# Altium schematic sheet Bridge.SchDoc
size A4
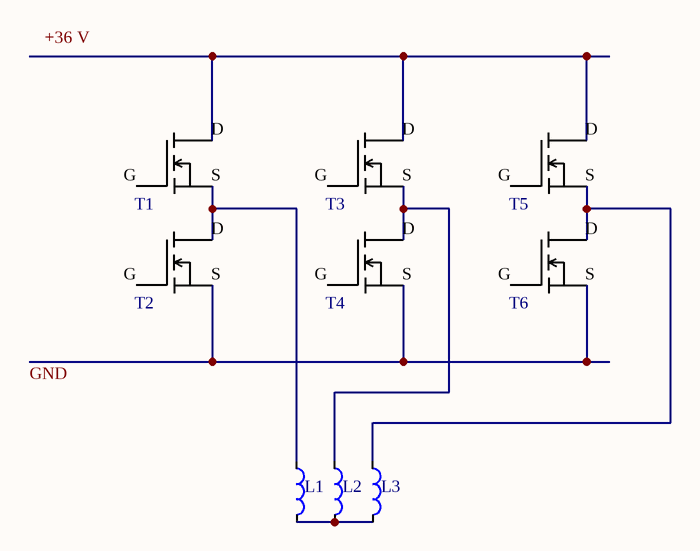
[diagram p0: Bridge.SchDoc]

## Parts
L1  Inductance  (value not drawn)
L2  Inductance  (value not drawn)
L3  Inductance  (value not drawn)
T1  MOSFET_Isolated_Gate  (value not drawn)
T2  MOSFET_Isolated_Gate  (value not drawn)
T3  MOSFET_Isolated_Gate  (value not drawn)
T4  MOSFET_Isolated_Gate  (value not drawn)
T5  MOSFET_Isolated_Gate  (value not drawn)
T6  MOSFET_Isolated_Gate  (value not drawn)

## Nets
NetL1_1: L1.1 T1.S T2.D
NetL1_2: L1.2 L2.2 L3.2
NetL2_1: L2.1 T3.S T4.D
NetL3_1: L3.1 T5.S T6.D
NetT1_D: T1.D T3.D T5.D
NetT2_S: T2.S T4.S T6.S

Not connected (* = marked no-connect by the designer): T1 G(1); T2 G(1); T3 G(1); T4 G(1); T5 G(1); T6 G(1)

## Notes on the sheet
- Labels drawn without touching a wire or pin: +36 V, GND